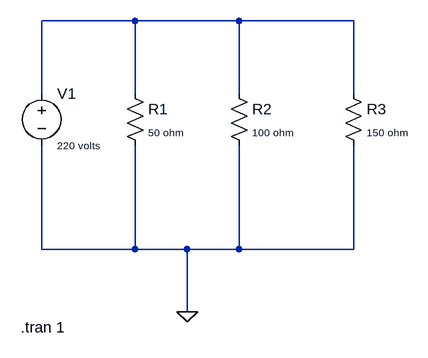
[diagram p0: schematic Draft1.asc]
Draft1.asc, the LTspice schematic file:
Version 4
SHEET 1 880 680
WIRE 16 16 -128 16
WIRE 176 16 16 16
WIRE 352 16 176 16
WIRE -128 128 -128 16
WIRE 16 128 16 16
WIRE 176 128 176 16
WIRE 352 128 352 16
WIRE -128 368 -128 208
WIRE 16 368 16 208
WIRE 16 368 -128 368
WIRE 96 368 16 368
WIRE 176 368 176 208
WIRE 176 368 96 368
WIRE 352 368 352 208
WIRE 352 368 176 368
WIRE 96 464 96 368
FLAG 96 464 0
SYMBOL res 0 112 R0
WINDOW 3 36 76 Left 1
SYMATTR Value 50 ohm
SYMATTR InstName R1
SYMBOL res 160 112 R0
WINDOW 3 36 76 Left 1
SYMATTR Value 100 ohm
SYMATTR InstName R2
SYMBOL res 336 112 R0
WINDOW 3 36 76 Left 1
SYMATTR Value 150 ohm
SYMATTR InstName R3
SYMBOL voltage -128 112 R0
WINDOW 3 24 96 Left 1
SYMATTR Value 220 volts
SYMATTR InstName V1
TEXT -160 488 Left 2 !.tran 1

The netlist it stands for:
* Draft1.asc
R1 N001 0 50 ohm
R2 N001 0 100 ohm
R3 N001 0 150 ohm
V1 N001 0 220 volts
.tran 1
.backanno
.end

* Results of the author's LTspice run, read from the files saved beside the schematic
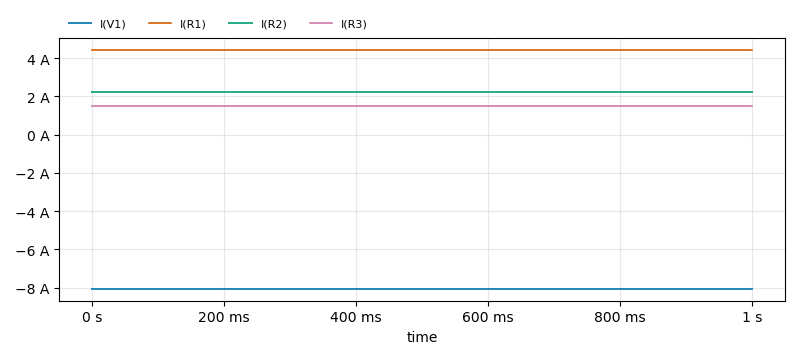
[diagram p1: Transient Analysis of Draft1.asc, plotted from the saved traces]
* Transient Analysis, 1 run:
*   I(V1): min -8.067 A, max -8.067 A, average -8.067 A, rms 8.067 A, last -8.067 A
*   I(R1): min 4.4 A, max 4.4 A, average 4.4 A, rms 4.4 A, last 4.4 A
*   I(R2): min 2.2 A, max 2.2 A, average 2.2 A, rms 2.2 A, last 2.2 A
*   I(R3): min 1.467 A, max 1.467 A, average 1.467 A, rms 1.467 A, last 1.467 A